# Altium schematic sheet LCD Controler SCH.SchDoc
size A3
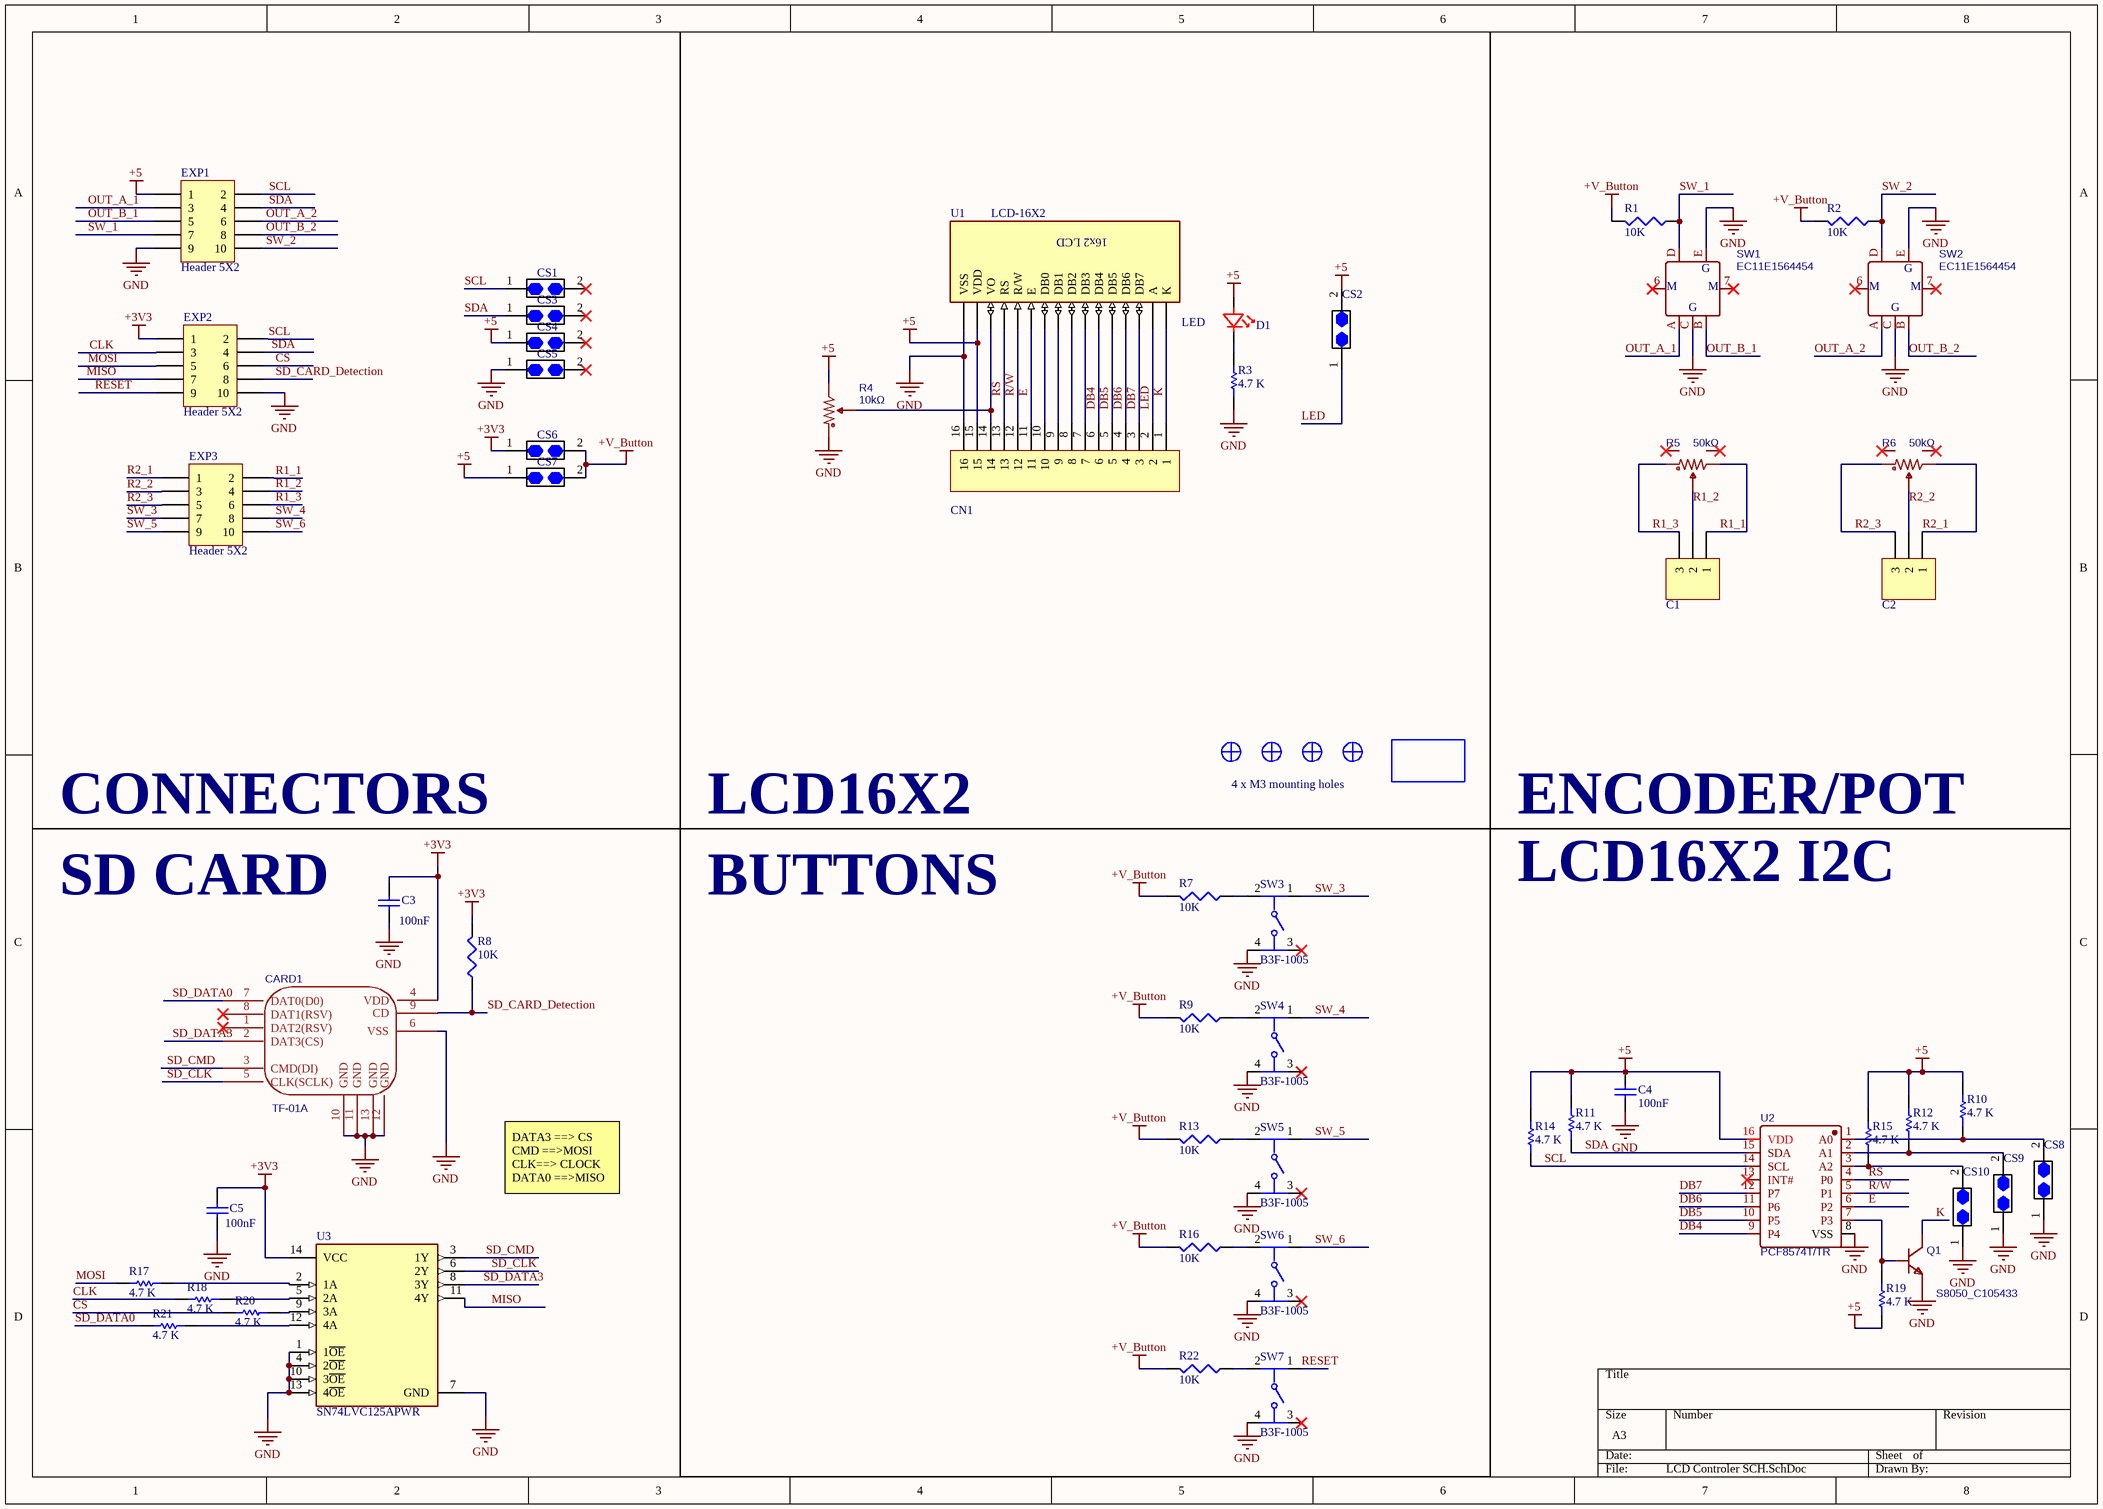
[diagram p0: LCD Controler SCH.SchDoc]

## Parts
C1  Header 3  [HDR1X3-HEADER]  (value not drawn)
C2  Header 3  [HDR1X3-HEADER]  (value not drawn)
C3  100nF  [Cap 1608-0603]
C4  100nF  [Cap 1608-0603]
C5  100nF  [Cap 1608-0603]
CARD1  TF-01A  [TF-SMD_TF-01A2]
CN1  Header 16  [HDR1X16-HEADER]  (value not drawn)  (no BOM)
CS1  CHEVRON  [CHEV]  (value not drawn)  (net tie, no BOM)
CS2  CHEVRON  [CHEV]  (value not drawn)  (net tie, no BOM)
CS3  CHEVRON  [CHEV]  (value not drawn)  (net tie, no BOM)
CS4  CHEVRON  [CHEV]  (value not drawn)  (net tie, no BOM)
CS5  CHEVRON  [CHEV]  (value not drawn)  (net tie, no BOM)
CS6  CHEVRON  [CHEV]  (value not drawn)  (net tie, no BOM)
CS7  CHEVRON  [CHEV]  (value not drawn)  (net tie, no BOM)
CS8  CHEVRON  [CHEV]  (value not drawn)  (net tie, no BOM)
CS9  CHEVRON  [CHEV]  (value not drawn)  (net tie, no BOM)
CS10  CHEVRON  [CHEV]  (value not drawn)  (net tie, no BOM)
D1  LED  [LED_0603R]
EXP1  Header 5X2  [HDR2X5_exp Iner only\]
EXP2  Header 5X2  [HDR2X5_exp Iner only\]
EXP3  Header 5X2  [HDR2X5_exp Iner only\]
OS_logo1  Logo  [OS LOGO TOP]  (value not drawn)  (no BOM)
Q1  S8050_C105433  [SOT-23-3_L2.9-W1.6-P1.90-LS2.8-BR]
R1  value 10K  [RES 1608-0603]  (hidden comment: resistor)
R2  value 10K  [RES 1608-0603]  (hidden comment: resistor)
R3  4.7 K  [0805]
R4  10kΩ  [RES-ADJ-TH_3362P]
R5  50kΩ  [RES-ADJ-TH_RK09L1140A5P]
R6  50kΩ  [RES-ADJ-TH_RK09L1140A5P]
R7  value 10K  [RES 1608-0603]  (hidden comment: resistor)
R8  value 10K  [RES 1608-0603]  (hidden comment: resistor)
R9  value 10K  [RES 1608-0603]  (hidden comment: resistor)
R10  4.7 K  [0805]
R11  4.7 K  [0805]
R12  4.7 K  [0805]
R13  value 10K  [RES 1608-0603]  (hidden comment: resistor)
R14  4.7 K  [0805]
R15  4.7 K  [0805]
R16  value 10K  [RES 1608-0603]  (hidden comment: resistor)
R17  4.7 K  [0805]
R18  4.7 K  [0805]
R19  4.7 K  [0805]
R20  4.7 K  [0805]
R21  4.7 K  [0805]
R22  value 10K  [RES 1608-0603]  (hidden comment: resistor)
sc1  Sraf  [Sraf 3mm - rupa 3.2]  (value not drawn)  (no BOM)
sc2  Sraf  [Sraf 3mm - rupa 3.2]  (value not drawn)  (no BOM)
sc3  Sraf  [Sraf 3mm - rupa 3.5]  (value not drawn)  (no BOM)
sc4  Sraf  [Sraf 3mm - rupa 3.5]  (value not drawn)  (no BOM)
SW1  EC11E1564454  [SW-TH_EC11E1564454]
SW2  EC11E1564454  [SW-TH_EC11E1564454]
SW3  B3F-1005  [FP-B3F-1005-MFG]
SW4  B3F-1005  [FP-B3F-1005-MFG]
SW5  B3F-1005  [FP-B3F-1005-MFG]
SW6  B3F-1005  [FP-B3F-1005-MFG]
SW7  B3F-1005  [FP-B3F-1005-MFG]
U1  LCD-16X2  [MODULE_LCD-16X2]  (no BOM)
U2  PCF8574T/TR  [SO-16_L10.3-W7.5-P1.27-LS10.3-BL]
U3  SN74LVC125APWR  [FP-PW0014A-IPC_B]

## Nets
+3V3: C3.1 C5.2 CARD1.4(VDD) CS6.1 EXP2.1 R8.2 U3.14(VCC)
+5: C4.1 CN1.15 CS2.2 CS4.1 CS7.1 D1.1 EXP1.1 R4.3 R10.2 R11.2 R12.2 R14.2 R15.2 R19.1 U1.2(VDD) U2.16(VDD)
+V_Button: CS6.2 CS7.2 R1.2 R2.2 R7.2 R9.2 R13.2 R16.2 R22.2
GND: C3.2 C4.2 C5.1 CARD1.6(VSS) CARD1.10(GND) CARD1.11(GND) CARD1.12(GND) CARD1.13(GND) CN1.16 CS5.1 CS8.1 CS9.1 CS10.1 EXP1.9 EXP2.10 Q1.2 R3.1 R4.1 SW1.C SW1.E SW2.C SW2.E SW3.4 SW4.4 SW5.4 SW6.4 SW7.4 U1.1(VSS) U2.8(VSS) U3.1(1~{OE}) U3.4(2~{OE}) U3.7(GND) U3.10(3~{OE}) U3.13(4~{OE})
CLK: EXP2.3 R18.2
CS: EXP2.6 R20.2
DB4: CN1.6 U1.11(DB4) U2.9(P4)
DB5: CN1.5 U1.12(DB5) U2.10(P5)
DB6: CN1.4 U1.13(DB6) U2.11(P6)
DB7: CN1.3 U1.14(DB7) U2.12(P7)
E: CN1.11 U1.6(E) U2.6(P2)
K: CN1.1 Q1.3 U1.16(K)
LED: CN1.2 CS2.1 U1.15(A)
MISO: EXP2.7 U3.11(4Y)
MOSI: EXP2.5 R17.2
OUT_A_1: EXP1.3 SW1.A
OUT_A_2: EXP1.6 SW2.A
OUT_B_1: EXP1.5 SW1.B
OUT_B_2: EXP1.8 SW2.B
R1_1: C1.1 EXP3.2 R5.3
R1_2: C1.2 EXP3.4 R5.2
R1_3: C1.3 EXP3.6 R5.1
R2_1: C2.1 EXP3.1 R6.3
R2_2: C2.2 EXP3.3 R6.2
R2_3: C2.3 EXP3.5 R6.1
R/W: CN1.12 U1.5(R/W) U2.5(P1)
RESET: EXP2.9 SW7.1
RS: CN1.13 U1.4(RS) U2.4(P0)
SCL: CS1.1 EXP1.2 EXP2.2 R14.1 U2.14(SCL)
SD_CARD_Detection: CARD1.9(CD) EXP2.8 R8.1
SD_CLK: CARD1.5(CLK(SCLK)) U3.6(2Y)
SD_CMD: CARD1.3(CMD(DI)) U3.3(1Y)
SD_DATA0: CARD1.7(DAT0(D0)) R21.2
SD_DATA3: CARD1.2(DAT3(CS)) U3.8(3Y)
SDA: CS3.1 EXP1.4 EXP2.4 R11.1 U2.15(SDA)
SW_1: EXP1.7 R1.1 SW1.D
SW_2: EXP1.10 R2.1 SW2.D
SW_3: EXP3.7 SW3.1
SW_4: EXP3.8 SW4.1
SW_5: EXP3.9 SW5.1
SW_6: EXP3.10 SW6.1
NetCN1_7: CN1.7 U1.10(DB3)
NetCN1_8: CN1.8 U1.9(DB2)
NetCN1_9: CN1.9 U1.8(DB1)
NetCN1_10: CN1.10 U1.7(DB0)
NetCN1_14: CN1.14 R4.2 U1.3(VO)
NetCS8_2: CS8.2 R10.1 U2.1(A0)
NetCS9_2: CS9.2 R12.1 U2.2(A1)
NetCS10_2: CS10.2 R15.1 U2.3(A2)
NetD1_2: D1.2 R3.2
NetQ1_1: Q1.1 R19.2 U2.7(P3)
NetR7_1: R7.1 SW3.2
NetR9_1: R9.1 SW4.2
NetR13_1: R13.1 SW5.2
NetR16_1: R16.1 SW6.2
NetR17_1: R17.1 U3.2(1A)
NetR18_1: R18.1 U3.5(2A)
NetR20_1: R20.1 U3.9(3A)
NetR21_1: R21.1 U3.12(4A)
NetR22_1: R22.1 SW7.2

Not connected (* = marked no-connect by the designer): CARD1 1(DAT2(RSV))* 8(DAT1(RSV))*; CS1 2*; CS3 2*; CS4 2*; CS5 2*; R5 4* 5*; R6 4* 5*; SW1 6(EH)* 7(EH)*; SW2 6(EH)* 7(EH)*; SW3 3*; SW4 3*; SW5 3*; SW6 3*; SW7 3*; U2 13(INT#)*

## Notes on the sheet
- 4 x M3 mounting holes
- CONNECTORS
- LCD16X2
- ENCODER/POT
- SD CARD
- BUTTONS
- LCD16X2 I2C
- DATA3 ==> CS
  CMD ==>MOSI
  CLK==> CLOCK
  DATA0 ==>MISO
- (in symbol EC11E1564454) G; M
- (in symbol LCD-16X2) 16x2 LCD

## Library data of the parts
C1 C2 = Header 3: Header, 3-Pin; Manufacturer 1: Generic Header; Manufacturer:: BOOMELE(Boom Precision Elec); Mfr.Part:: C49257; Note: Approved sub OK; LatestRevisionDate: 17-Jul-2002; LatestRevisionNote: Re-released for DXP Platform.; Publisher: Altium Limited; LCSC PART NUMBER: *; MANUF_REF: *; Supplier:: LCSC; Supplier.Part:: C49257
C3-C5 = CapC-0603-100nF: CAP CER 0.1UF 50V X7R 0603/0805; Mfr.Ref: CT41G-0805-2X1-50V-0.1μF-M(N); Mfr: TORCH; Revision: July-2002: Re-released for DXP Platform.; Supplier.Ref: C138340; Supplier: LSCS; Manufacturer:: TORCH; Mfr.Part:: CT41G-0805-2X1-50V-0.1μF-M(N); Supplier:: LCSC; Supplier.Part:: C138340; LCSC PART NUMBER: C138340; MANUF_REF: CT41G-0805-2X1-50V-0.1μF-M(N)
CARD1 = TF-01A: LCSC Part # C91145 / Manufacturer Korean Hroparts Elec; BOM_Manufacturer: 韩国韩荣; BOM_Supplier: LCSC; BOM_Manufacturer Part: TF-01A; BOM_Supplier Part: C91145; BOM_JLCPCB Part Class: Extended Part; spicePre: C; spiceSymbolName: TF-01A; Manufacturer:: Korean Hroparts Elec; Mfr.Part:: TF-01A; Supplier:: LCSC; Supplier.Part:: C91145; LCSC PART NUMBER: *; MANUF_REF: *
CN1 = Header 16x1: male; Manufacturer 1: Generic Header; Note: Approved sub OK; LatestRevisionDate: 17-Jul-2002; LatestRevisionNote: Re-released for DXP Platform.; Publisher: Altium Limited; LCSC PART NUMBER: *; MANUF_REF: *; Mfr.Part:: *; Manufacturer:: *; Supplier:: *; Supplier.Part:: *
D1 = Diode_LED: 20mA 639nm Colorless transparence -55℃~+85℃ 631nm~631nm Red 130° 75mW 0603 Light Emitting Diodes (LED) ROHS /; Mfr.Ref: LTST-C191KRKT; Mfr: LITEON; Manufacturer:: Lite-On; Supplier.Ref: C125099; Supplier: LCSC; Mfr.Part:: LTST-C191KRKT; Supplier:: LCSC; Supplier.Part:: C125099; LCSC PART NUMBER: *; MANUF_REF: *
EXP1-EXP3 = Header 5X2: Header, 5-Pin, Dual row; Manufacturer 1: Generic Header; Manufacturer:: PINREX; Mfr.Part:: 510-80-10GB43; Note: Approved sub OK; LatestRevisionDate: 17-Jul-2002; LatestRevisionNote: Re-released for DXP Platform.; Publisher: Altium Limited; Supplier:: LCSC; Supplier.Part:: C390693
OS_logo1 = Logo: Note: Approved sub OK; Manufacturer:: *; Mfr.Part:: *; Supplier:: *; Supplier.Part:: *
Q1 = S8050: 25V 300mW 120@50mA,1V 500mA NPN SOT-23 Bipolar Transistors - BJT ROHS; Manufacturer: CJ(江苏长电/长晶); Supplier: LCSC; Manufacturer Part: S8050; Supplier Part: C105433; JLCPCB Part Class: Extended Part; spicePre: Q; spiceSymbolName: S8050_C105433; Manufacturer:: CJ(江苏长电/长晶); Mfr.Part:: C105433; Supplier:: LCSC; Supplier.Part:: C105433
R1 R2 R7-R9 R13 R16 R22 = Res-0603-10K: RES SMD 10K OHM 1% 1/10W 0603; Manufacturer:: UNI-ROYAL(Uniroyal Elec); Mfr.Part:: 0805W8F1002T5E; Note: Approved sub OK; Published: 8-Jun-2000; Revision: July-2002: Re-released for DXP Platform.; Supplier 1: Digi-Key; Supplier Part Number 1: 311-10.0KHRCT-ND; Supplier:: LCSC; Supplier.Part:: C17414; LCSC PART NUMBER: *; MANUF_REF: *
R3 R10-R12 R14 R15 R17-R21 = Res-0805: MANUF_REF: RC0805FR-074K7L; Manufacturer:: YAGEO; LCSC PART NUMBER: C60816; Mfr.Part:: RC0805FR-074K7L; Supplier:: LCSC; Supplier.Part:: C60816
R4 = 3362P-1-103: ±10% 10kΩ Plugin Variable Resistors/Potentiometers ROHS /; Manufacturer: BOCHEN(博晨); Resistance(Ohms): 10K; nameAlias: Value; Contributor: LCSC; Supplier: LCSC; Supplier Part: C118956; Manufacturer Part: 3362P-1-103; JLCPCB Part Class: Extended Part; spicePre: R; spiceSymbolName: 3362P-1-103_C118956; Manufacturer:: BOCHEN(博晨); Mfr.Part:: 3362P-1-103; Supplier:: LCSC; Supplier.Part:: C118956
R5 R6 = Potentiometers  50kΩ vertical: Manufacturer: ALPSALPINE(阿尔卑斯阿尔派); Manufacturer Part: RK09L1140A5P; Contributor: LCSC; nameAlias: Value; Supplier Part: C231764; JLCPCB Part Class: Extended Part; spicePre: R; spiceSymbolName: RK09L1140A5P; Manufacturer:: ALPSALPINE(阿尔卑斯阿尔派); Mfr.Part:: RK09L1140A5P; Supplier:: LCSC; Supplier.Part:: C231764
sc1-sc4 = Sraf: Note: Approved sub OK; Manufacturer:: *; Mfr.Part:: *; Supplier:: *; Supplier.Part:: *
SW1 SW2 = EC11E1564454: Plugin Rotary Encoders ROHS; Manufacturer: ALPSALPINE; Contributor: LCSC; Supplier: LCSC; Supplier Part: C1322545; Manufacturer Part: EC11E1564454; JLCPCB Part Class: Extended Part; spicePre: S; spiceSymbolName: EC11E1564454; Manufacturer:: ALPSALPINE; Mfr.Part:: EC11E1564454; Supplier:: LCSC; Supplier.Part:: C1322545
SW3-SW7 = CMP-08834-000043-1: SWITCH TACTILE SPST-NO 0.05A 24V; Manufacturer:: Omron Electronics; Contact Current Rating: 50mA; Switch Travel: 0.25mm; Mechanical Life: 100000Cycles; Switch Function: Off-Mom; Throw Configuration: SPST; Illumination Type: Non-Illuminated; Actuator Type: Standard; Electrical Life: 300000Cycles; Number of Poles: 1; Ratings: IP00; Actuator Color: Orange; Contact Resistance: 100mR; Operating Force: 2.55N; Actuator Length: 0.9mm; Weight: 0.25g; Max Operating Temperature: 70°C; Packaging: Bag; Depth: 6mm; Package Quantity: 1500; Lead Free: Lead Free; Voltage Rating (DC): 24V; Termination: PC Pins; Length: 6mm; Contact Material: Gold; Min Operating Temperature: -25°C; Mount: Through Hole; Max Voltage Rating (DC): 24V; Current Rating: 50mA; Max Current Rating: 50mA; Orientation: Straight; Width: 6mm; Height: 4.3mm; Series: B3F; Contact Plating: Silver; Mfr.Part:: B3F-1005; Supplier:: LCSC; Supplier.Part:: C397293
U1 = LCD-16X2: Display Development Tools 16x2 Black on Green Char LCD w Backlight; MF: Gravitech; Package: None; Price: None; Value: *; SnapEDA_Link: https://www.snapeda.com/parts/LCD-16X2/Gravitech/view-part/?ref=snap; MP: LCD-16X2; Availability: Not in stock; Check_prices: https://www.snapeda.com/parts/LCD-16X2/Gravitech/view-part/?ref=eda; Manufacturer:: *; Mfr.Part:: *; Supplier:: *; Supplier.Part:: *
U2 = PCF8574T/TR: Communication Interface Chip/UART/485/232/I/O Expanders; Manufacturer: HGSEMI(华冠); Contributor: lcsc; Supplier: LCSC; Supplier Part: C2987288; Manufacturer Part: PCF8574T/TR; JLCPCB Part Class: Extended Part; spicePre: U; spiceSymbolName: PCF8574T/TR; Manufacturer:: HGSEMI(华冠); Mfr.Part:: PCF8574T/TR; Supplier:: LCSC; Supplier.Part:: C2987288
U3 = CMP-0440-00179-4: IC BUF NON-INVERT 3.6V 14TSSOP; Manufacturer:: Texas Instruments; Max Power Dissipation: 500mW; Number of Bits per Element: 1; Number of Bits: 4; Quiescent Current: 1uA; Min Supply Voltage: 1.65V; Propagation Delay: 4.6ns; High Level Output Current: -24mA; Logic Function: Buffer; Low Level Output Current: 24mA; Polarity: Non-Inverting; Turn-On Delay Time: 5.3ns; Number of Output Lines: 3; Mount: Surface Mount; Lead Free: Lead Free; Number of Outputs: 4; Max Supply Voltage: 3.6V; Packaging: Tape and Reel; Radiation Hardening: No; Number of Channels: 4; REACH SVHC: No SVHC; Length: 5mm; Number of Elements: 4; Contact Plating: Gold; Case/Package: TSSOP; Number of Input Lines: 4; Number of Inputs: 4; Height: 1.15mm; Number of Circuits: 4; Termination: SMD/SMT; Min Operating Temperature: -40°C; Package Quantity: 1; Number of Gates: 4; Max Operating Temperature: 125°C; Width: 4.4mm; Number of Pins: 14; LCSC PART NUMBER: *; MANUF_REF: *; Mfr.Part:: SN74LVC125APWR; Supplier:: LCSC; Supplier.Part:: C7813
CS1-CS10 = CHEVRON: LCSC PART NUMBER: *; MANUF_REF: *; Manufacturer:: *; Mfr.Part:: *; Supplier:: LCSC; Supplier.Part:: *